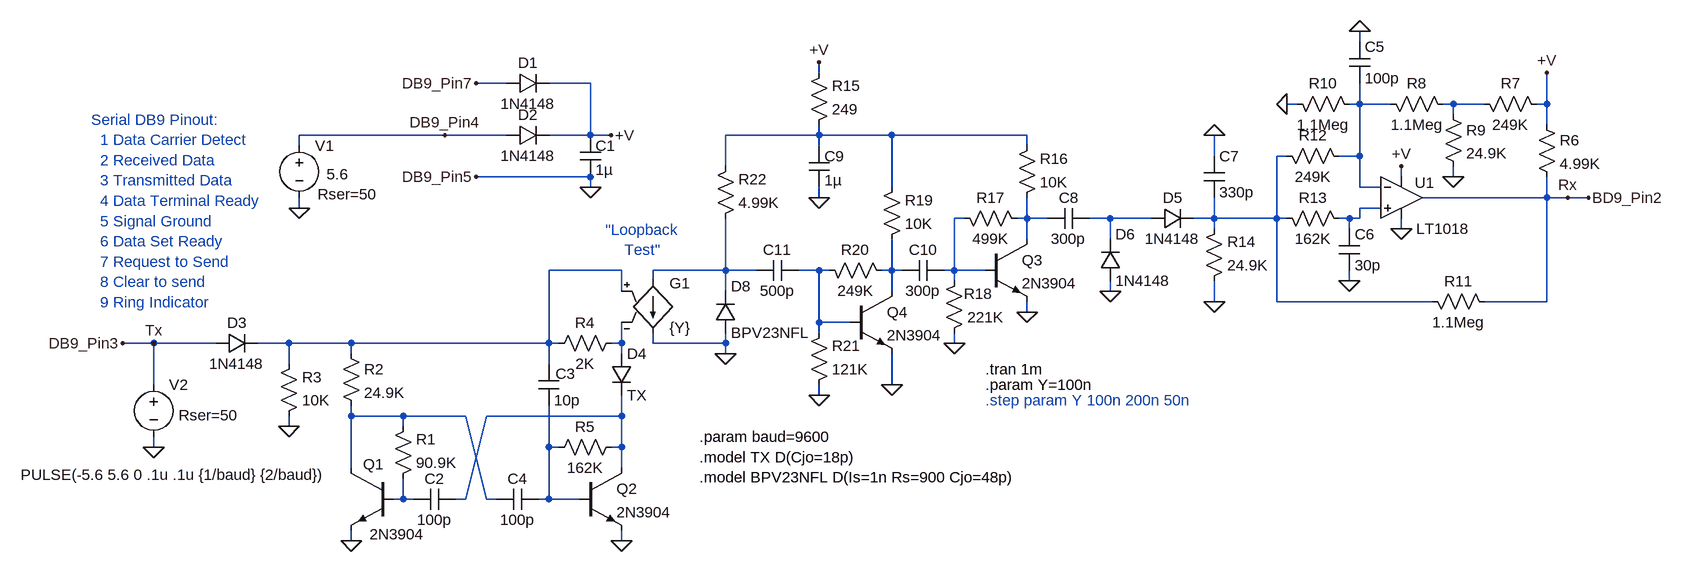
[diagram p0: schematic Schematic.asc]
Schematic.asc, the LTspice schematic file:
Version 4
SHEET 1 1388 1092
WIRE 432 -288 432 -304
WIRE -400 -240 -400 -256
WIRE -880 -224 -928 -224
WIRE -752 -224 -816 -224
WIRE 336 -192 320 -192
WIRE 432 -192 432 -224
WIRE 432 -192 416 -192
WIRE 480 -192 432 -192
WIRE 576 -192 560 -192
WIRE 624 -192 576 -192
WIRE 720 -192 720 -240
WIRE 720 -192 704 -192
WIRE 576 -176 576 -192
WIRE 720 -160 720 -192
WIRE -976 -144 -1200 -144
WIRE -880 -144 -976 -144
WIRE -752 -144 -752 -224
WIRE -752 -144 -816 -144
WIRE -720 -144 -752 -144
WIRE -400 -144 -400 -160
WIRE -400 -144 -544 -144
WIRE -288 -144 -400 -144
WIRE -80 -144 -288 -144
WIRE -1200 -128 -1200 -144
WIRE -400 -128 -400 -144
WIRE -80 -128 -80 -144
WIRE 208 -112 208 -144
WIRE 320 -112 304 -112
WIRE 432 -112 432 -192
WIRE 432 -112 400 -112
WIRE -544 -96 -544 -144
WIRE -752 -80 -928 -80
WIRE 496 -80 496 -96
WIRE 576 -80 576 -96
WIRE -752 -64 -752 -80
WIRE -288 -64 -288 -144
WIRE 432 -64 432 -112
WIRE 464 -64 432 -64
WIRE -400 -48 -400 -64
WIRE 720 -48 720 -80
WIRE 720 -48 528 -48
WIRE 752 -48 720 -48
WIRE 784 -48 752 -48
WIRE -1200 -32 -1200 -48
WIRE 464 -32 432 -32
WIRE -176 -16 -192 -16
WIRE -80 -16 -80 -48
WIRE -80 -16 -96 -16
WIRE -48 -16 -80 -16
WIRE 48 -16 16 -16
WIRE 112 -16 48 -16
WIRE 208 -16 208 -48
WIRE 208 -16 176 -16
WIRE 304 -16 304 -112
WIRE 304 -16 208 -16
WIRE 320 -16 304 -16
WIRE 416 -16 400 -16
WIRE 432 -16 432 -32
WIRE 432 -16 416 -16
WIRE 208 0 208 -16
WIRE 416 0 416 -16
WIRE 496 0 496 -16
WIRE -80 16 -80 -16
WIRE 48 16 48 -16
WIRE -704 64 -816 64
WIRE -544 64 -544 -16
WIRE -544 64 -656 64
WIRE -496 64 -544 64
WIRE -400 64 -432 64
WIRE -384 64 -400 64
WIRE -288 64 -288 16
WIRE -288 64 -304 64
WIRE -272 64 -288 64
WIRE -192 64 -192 -16
WIRE -192 64 -208 64
WIRE -144 64 -192 64
WIRE -656 80 -656 64
WIRE -192 80 -192 64
WIRE 416 80 416 64
WIRE -704 96 -704 64
WIRE -544 96 -544 64
WIRE -288 96 -288 64
WIRE 48 96 48 80
WIRE 208 112 208 80
WIRE 304 112 304 -16
WIRE 544 112 304 112
WIRE 720 112 720 -48
WIRE 720 112 624 112
WIRE -80 128 -80 112
WIRE -400 144 -400 64
WIRE -352 144 -400 144
WIRE -400 160 -400 144
WIRE -1424 176 -1472 176
WIRE -1328 176 -1424 176
WIRE -1216 176 -1264 176
WIRE -1120 176 -1216 176
WIRE -816 176 -816 64
WIRE -816 176 -1120 176
WIRE -800 176 -816 176
WIRE -704 176 -704 144
WIRE -704 176 -720 176
WIRE -656 176 -656 160
WIRE -544 176 -544 160
WIRE -544 176 -656 176
WIRE -192 176 -192 160
WIRE -1120 192 -1120 176
WIRE -704 192 -704 176
WIRE -544 192 -544 176
WIRE -1216 208 -1216 176
WIRE -816 208 -816 176
WIRE -1424 240 -1424 176
WIRE -288 240 -288 192
WIRE -400 256 -400 240
WIRE -1120 288 -1120 272
WIRE -1040 288 -1120 288
WIRE -944 288 -1040 288
WIRE -704 288 -704 256
WIRE -704 288 -912 288
WIRE -1216 304 -1216 288
WIRE -1040 304 -1040 288
WIRE -1424 336 -1424 320
WIRE -816 336 -816 272
WIRE -800 336 -816 336
WIRE -704 336 -704 288
WIRE -704 336 -720 336
WIRE -1120 368 -1120 288
WIRE -704 368 -704 336
WIRE -1040 416 -1040 384
WIRE -1040 416 -1056 416
WIRE -1024 416 -1040 416
WIRE -944 416 -912 288
WIRE -944 416 -960 416
WIRE -912 416 -944 288
WIRE -896 416 -912 416
WIRE -816 416 -816 336
WIRE -816 416 -832 416
WIRE -768 416 -816 416
WIRE -1120 480 -1120 464
WIRE -704 480 -704 464
FLAG -1200 -32 0
FLAG -1424 336 0
FLAG -720 -144 +V
FLAG -928 -80 DB9_Pin5
FLAG -976 -144 DB9_Pin4
FLAG -1472 176 DB9_Pin3
FLAG -1424 176 Tx
FLAG -752 -64 0
FLAG -544 192 0
FLAG -288 240 0
FLAG -400 256 0
FLAG -400 -256 +V
FLAG -400 -48 0
FLAG -80 128 0
FLAG -192 176 0
FLAG 496 0 0
FLAG 720 -240 +V
FLAG 320 -192 0
FLAG 496 -96 +V
FLAG 48 96 0
FLAG 208 112 0
FLAG 208 -144 0
FLAG 432 -304 0
FLAG 576 -80 0
FLAG 416 80 0
FLAG 784 -48 BD9_Pin2
FLAG 752 -48 Rx
FLAG -1120 480 0
FLAG -704 480 0
FLAG -1216 304 0
FLAG -928 -224 DB9_Pin7
SYMBOL voltage -1200 -144 R0
WINDOW 3 42 60 Left 0
WINDOW 123 0 0 Left 0
WINDOW 39 28 91 Left 0
SYMATTR Value 5.6
SYMATTR SpiceLine Rser=50
SYMATTR InstName V1
SYMBOL res -816 192 R270
WINDOW 0 32 56 VTop 0
WINDOW 3 0 56 VBottom 0
SYMATTR InstName R4
SYMATTR Value 2K
SYMBOL npn -768 368 R0
SYMATTR InstName Q2
SYMATTR Value 2N3904
SYMBOL npn -1056 368 M0
WINDOW 0 46 -6 Right 0
WINDOW 3 36 102 Right 0
SYMATTR InstName Q1
SYMATTR Value 2N3904
SYMBOL res -1136 176 R0
SYMATTR InstName R2
SYMATTR Value 24.9K
SYMATTR SpiceLine tol=1 pwr=0.1
SYMBOL cap -832 400 R90
WINDOW 0 0 32 VBottom 0
WINDOW 3 32 32 VTop 0
SYMATTR InstName C4
SYMATTR Value 100p
SYMBOL cap -960 400 R90
WINDOW 0 0 32 VBottom 0
WINDOW 3 32 32 VTop 0
SYMATTR InstName C2
SYMATTR Value 100p
SYMBOL res -1056 400 M180
WINDOW 0 36 76 Left 0
WINDOW 3 36 40 Left 0
SYMATTR InstName R1
SYMATTR Value 90.9K
SYMBOL res -704 320 R90
WINDOW 0 0 56 VBottom 0
WINDOW 3 32 56 VTop 0
SYMATTR InstName R5
SYMATTR Value 162K
SYMBOL voltage -1424 224 R0
WINDOW 123 0 0 Left 0
WINDOW 39 38 63 Left 0
WINDOW 3 32 139 Top 0
SYMATTR SpiceLine Rser=50
SYMATTR Value PULSE(-5.6 5.6 0 .1u .1u {1/baud} {2/baud})
SYMATTR InstName V2
SYMBOL diode -1328 160 M90
WINDOW 0 0 32 VBottom 0
WINDOW 3 32 32 VTop 0
SYMATTR InstName D3
SYMATTR Value 1N4148
SYMBOL cap -768 -144 R0
WINDOW 0 24 16 Left 0
WINDOW 3 24 53 Left 0
SYMATTR InstName C1
SYMATTR Value 1µ
SYMBOL diode -720 192 R0
SYMATTR InstName D4
SYMATTR Value TX
SYMBOL diode -880 -160 M90
WINDOW 0 0 32 VBottom 0
WINDOW 3 32 32 VTop 0
SYMATTR InstName D2
SYMATTR Value 1N4148
SYMBOL diode -560 160 M180
WINDOW 0 24 72 Left 0
WINDOW 3 24 0 Left 0
SYMATTR InstName D8
SYMATTR Value BPV23NFL
SYMBOL g2 -656 176 M180
WINDOW 0 26 92 Left 0
WINDOW 3 26 24 Left 0
SYMATTR InstName G1
SYMATTR Value {Y}
SYMBOL res -560 0 M180
WINDOW 0 36 76 Left 0
WINDOW 3 36 40 Left 0
SYMATTR InstName R22
SYMATTR Value 4.99K
SYMATTR SpiceLine tol=1 pwr=0.1
SYMBOL npn -352 96 R0
SYMATTR InstName Q4
SYMATTR Value 2N3904
SYMBOL res -304 32 M180
WINDOW 0 36 76 Left 0
WINDOW 3 36 40 Left 0
SYMATTR InstName R19
SYMATTR Value 10K
SYMATTR SpiceLine tol=1 pwr=0.1
SYMBOL res -400 48 M90
WINDOW 0 0 56 VBottom 0
WINDOW 3 32 56 VTop 0
SYMATTR InstName R20
SYMATTR Value 249K
SYMATTR SpiceLine tol=1 pwr=0.1
SYMBOL res -416 256 M180
WINDOW 0 36 76 Left 0
WINDOW 3 36 40 Left 0
SYMATTR InstName R21
SYMATTR Value 121K
SYMATTR SpiceLine tol=1 pwr=0.1
SYMBOL cap -432 80 M270
WINDOW 0 32 32 VTop 0
WINDOW 3 0 32 VBottom 0
SYMATTR InstName C11
SYMATTR Value 500p
SYMBOL cap -416 -128 R0
WINDOW 0 24 16 Left 0
WINDOW 3 24 53 Left 0
SYMATTR InstName C9
SYMATTR Value 1µ
SYMBOL res -416 -144 M180
WINDOW 0 36 76 Left 0
WINDOW 3 36 40 Left 0
SYMATTR InstName R15
SYMATTR Value 249
SYMBOL npn -144 16 R0
SYMATTR InstName Q3
SYMATTR Value 2N3904
SYMBOL res -96 -32 M180
WINDOW 0 36 76 Left 0
WINDOW 3 36 40 Left 0
SYMATTR InstName R16
SYMATTR Value 10K
SYMATTR SpiceLine tol=1 pwr=0.1
SYMBOL res -192 -32 M90
WINDOW 0 0 56 VBottom 0
WINDOW 3 32 56 VTop 0
SYMATTR InstName R17
SYMATTR Value 499K
SYMATTR SpiceLine tol=1 pwr=0.1
SYMBOL res -208 176 M180
WINDOW 0 31 76 Left 0
WINDOW 3 36 40 Left 0
SYMATTR InstName R18
SYMATTR Value 221K
SYMATTR SpiceLine tol=1 pwr=0.1
SYMBOL cap -208 80 M270
WINDOW 0 32 32 VTop 0
WINDOW 3 0 32 VBottom 0
SYMATTR InstName C10
SYMATTR Value 300p
SYMBOL res 576 -176 M270
WINDOW 0 32 56 VTop 0
WINDOW 3 0 56 VBottom 0
SYMATTR InstName R8
SYMATTR Value 1.1Meg
SYMBOL res 432 -176 M270
WINDOW 0 32 56 VTop 0
WINDOW 3 0 56 VBottom 0
SYMATTR InstName R10
SYMATTR Value 1.1Meg
SYMBOL res 192 96 M180
WINDOW 0 36 76 Left 0
WINDOW 3 36 40 Left 0
SYMATTR InstName R14
SYMATTR Value 24.9K
SYMATTR SpiceLine tol=1 pwr=0.1
SYMBOL cap 192 -48 M180
WINDOW 0 24 64 Left 0
WINDOW 3 24 8 Left 0
SYMATTR InstName C7
SYMATTR Value 330p
SYMBOL cap 416 -288 R0
SYMATTR InstName C5
SYMATTR Value 100p
SYMBOL res 560 -192 R0
SYMATTR InstName R9
SYMATTR Value 24.9K
SYMATTR SpiceLine tol=1 pwr=0.1
SYMBOL res 720 -176 M270
WINDOW 0 32 56 VTop 0
WINDOW 3 0 56 VBottom 0
SYMATTR InstName R7
SYMATTR Value 249K
SYMBOL cap 400 0 R0
SYMATTR InstName C6
SYMATTR Value 30p
SYMBOL cap 16 0 M270
WINDOW 0 32 32 VTop 0
WINDOW 3 0 32 VBottom 0
SYMATTR InstName C8
SYMATTR Value 300p
SYMBOL diode 112 0 R270
WINDOW 0 32 32 VTop 0
WINDOW 3 0 32 VBottom 0
SYMATTR InstName D5
SYMATTR Value 1N4148
SYMBOL diode 32 80 M180
WINDOW 0 24 72 Left 0
WINDOW 3 24 0 Left 0
SYMATTR InstName D6
SYMATTR Value 1N4148
SYMBOL res 704 -176 R0
SYMATTR InstName R6
SYMATTR Value 4.99K
SYMATTR SpiceLine tol=1 pwr=0.1
SYMBOL res 304 -32 M90
WINDOW 0 0 56 VBottom 0
WINDOW 3 32 56 VTop 0
SYMATTR InstName R13
SYMATTR Value 162K
SYMATTR SpiceLine tol=1 pwr=0.1
SYMBOL Comparators\\LT1018 496 -48 R0
WINDOW 0 21 -23 Left 0
WINDOW 3 23 48 Left 0
SYMATTR InstName U1
SYMBOL res 304 -128 M90
WINDOW 0 0 56 VBottom 0
WINDOW 3 32 56 VTop 0
SYMATTR InstName R12
SYMATTR Value 249K
SYMATTR SpiceLine tol=1 pwr=0.1
SYMBOL res 640 128 M270
WINDOW 0 32 56 VTop 0
WINDOW 3 0 56 VBottom 0
SYMATTR InstName R11
SYMATTR Value 1.1Meg
SYMBOL res -1232 304 M180
WINDOW 0 36 76 Left 0
WINDOW 3 36 40 Left 0
SYMATTR InstName R3
SYMATTR Value 10K
SYMATTR SpiceLine tol=1 pwr=0.1
SYMBOL diode -880 -240 M90
WINDOW 0 0 32 VBottom 0
WINDOW 3 32 32 VTop 0
SYMATTR InstName D1
SYMATTR Value 1N4148
SYMBOL cap -832 272 M180
WINDOW 0 26 49 Left 0
WINDOW 3 24 8 Left 0
SYMATTR InstName C3
SYMATTR Value 10p
TEXT -144 216 Left 0 !.tran 1m
TEXT -144 240 Left 0 !.param Y=100n
TEXT -144 264 Left 0 ;.step param Y 100n 200n 50n
TEXT -1520 -168 Left 0 ;Serial DB9 Pinout:\n  1 Data Carrier Detect\n  2 Received Data\n  3 Transmitted Data\n  4 Data Terminal Ready\n  5 Signal Ground\n  6 Data Set Ready\n  7 Request to Send\n  8 Clear to send\n  9 Ring Indicator
TEXT -584 320 Left 0 !.param baud=9600\n.model TX D(Cjo=18p)\n.model BPV23NFL D(Is=1n Rs=900 Cjo=48p)
TEXT -672 48 Bottom 0 ;"Loopback\nTest"

The netlist it stands for:
* Schematic.asc
V1 DB9_Pin4 0 5.6 Rser=50
R4 N009 N013 2K
Q2 N015 N016 0 0 2N3904
Q1 N014 N017 0 0 2N3904
R2 N009 N014 24.9K tol=1 pwr=0.1
C4 N016 N014 100p
C2 N015 N017 100p
R1 N017 N014 90.9K
R5 N015 N016 162K
V2 Tx 0 PULSE(-5.6 5.6 0 .1u .1u {1/baud} {2/baud}) Rser=50
D3 Tx N009 1N4148
C1 +V 0 1µ
D4 N013 N015 TX
D2 DB9_Pin4 +V 1N4148
D8 0 N010 BPV23NFL
G1 N010 0 N009 N013 {Y}
R22 N010 N003 4.99K tol=1 pwr=0.1
Q4 N012 N011 0 0 2N3904
R19 N012 N003 10K tol=1 pwr=0.1
R20 N011 N012 249K tol=1 pwr=0.1
R21 0 N011 121K tol=1 pwr=0.1
C11 N011 N010 500p
C9 N003 0 1µ
R15 N003 +V 249
Q3 N007 N006 0 0 2N3904
R16 N007 N003 10K tol=1 pwr=0.1
R17 N006 N007 499K tol=1 pwr=0.1
R18 0 N006 221K tol=1 pwr=0.1
C10 N006 N012 300p
R8 N002 N001 1.1Meg
R10 N001 0 1.1Meg
R14 0 N004 24.9K tol=1 pwr=0.1
C7 N004 0 330p
C5 0 N001 100p
R9 N002 0 24.9K tol=1 pwr=0.1
R7 +V N002 249K
C6 N005 0 30p
C8 N008 N007 300p
D5 N008 N004 1N4148
D6 0 N008 1N4148
R6 +V Rx 4.99K tol=1 pwr=0.1
R13 N004 N005 162K tol=1 pwr=0.1
XU1 N005 N001 +V 0 Rx LT1018  ; pins In+ In- V+ V- OUT
R12 N004 N001 249K tol=1 pwr=0.1
R11 Rx N004 1.1Meg
R3 0 N009 10K tol=1 pwr=0.1
D1 DB9_Pin7 +V 1N4148
C3 N016 N009 10p
.model D D
.lib standard.dio
.model NPN NPN
.model PNP PNP
.lib standard.bjt
.tran 1m
.param Y=100n
* .step param Y 100n 200n 50n
* Serial DB9 Pinout:
*   1 Data Carrier Detect
*   2 Received Data
*   3 Transmitted Data
*   4 Data Terminal Ready
*   5 Signal Ground
*   6 Data Set Ready
*   7 Request to Send
*   8 Clear to send
*   9 Ring Indicator
.param baud=9600
.model TX D(Cjo=18p)
.model BPV23NFL D(Is=1n Rs=900 Cjo=48p)
* "Loopback
* Test"
.lib LTC1.lib
.backanno
.end